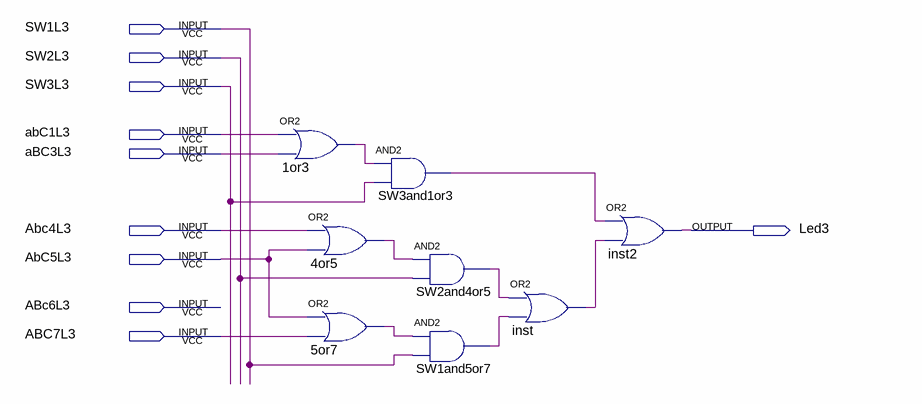
[diagram p0: schematic sheet]
// Quartus schematic Led3.bdf as structural Verilog: 8 symbols, 10 pins
module Led3 (
  input  SW1L3,
  input  SW2L3,
  input  SW3L3,
  input  abC1L3,
  input  aBC3L3,
  input  Abc4L3,
  input  AbC5L3,
  input  ABc6L3,
  input  ABC7L3,
  output Led3
);

  wire inst_out, n1or3_out, n4or5_out, n5or7_out, SW1and5or7_out, SW2and4or5_out, SW3and1or3_out;

  or u_1or3 (n1or3_out, abC1L3, aBC3L3);
  or u_4or5 (n4or5_out, Abc4L3, AbC5L3);
  or u_5or7 (n5or7_out, AbC5L3, ABC7L3);
  and SW3and1or3 (SW3and1or3_out, n1or3_out, SW3L3);
  and SW2and4or5 (SW2and4or5_out, n4or5_out, SW2L3);
  and SW1and5or7 (SW1and5or7_out, n5or7_out, SW1L3);
  or inst (inst_out, SW2and4or5_out, SW1and5or7_out);
  or inst2 (Led3, SW3and1or3_out, inst_out);
endmodule
